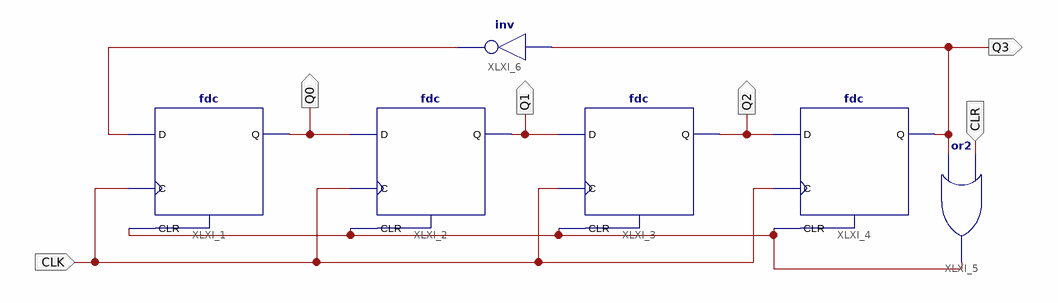
[diagram p0: schematic sheet 1]
// Xilinx ISE schematic p3ej1b.sch (spartan3) as structural Verilog: 6 symbols, 6 ports
module p3ej1b (
  input  CLR,
  input  CLK,
  output Q3,
  output Q0,
  output Q1,
  output Q2
);

  wire XLXN_4, XLXN_13;

  fdc XLXI_1 (.C(CLK), .CLR(XLXN_4), .D(XLXN_13), .Q(Q0));
  fdc XLXI_2 (.C(CLK), .CLR(XLXN_4), .D(Q0), .Q(Q1));
  fdc XLXI_3 (.C(CLK), .CLR(XLXN_4), .D(Q1), .Q(Q2));
  fdc XLXI_4 (.C(CLK), .CLR(XLXN_4), .D(Q2), .Q(Q3));
  or XLXI_5 (XLXN_4, Q3, CLR);
  not XLXI_6 (XLXN_13, Q3);
endmodule
